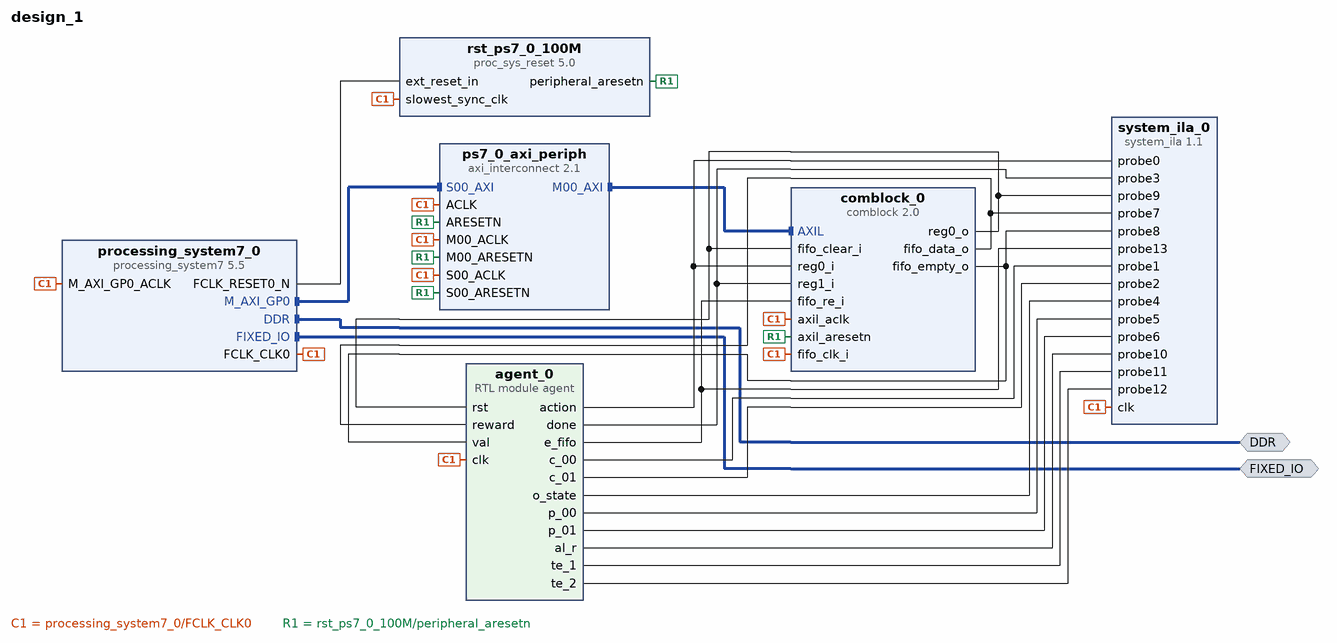
[diagram p0: block diagram of the top level]
# Vivado block design design_1, xc7z020clg484-1, Vivado 2022.1
create_bd_design design_1

create_bd_intf_port -mode Master -vlnv xilinx.com:interface:ddrx_rtl:1.0 DDR
create_bd_intf_port -mode Master -vlnv xilinx.com:display_processing_system7:fixedio_rtl:1.0 FIXED_IO

create_bd_cell -type ip -vlnv xilinx.com:ip:processing_system7:5.5 processing_system7_0
set_property -dict [list \
  CONFIG.PCW_APU_PERIPHERAL_FREQMHZ 666.666667 \
  CONFIG.PCW_ENET0_ENET0_IO {MIO 16 .. 27} \
  CONFIG.PCW_ENET0_GRP_MDIO_ENABLE 1 \
  CONFIG.PCW_ENET0_GRP_MDIO_IO {MIO 52 .. 53} \
  CONFIG.PCW_ENET0_PERIPHERAL_ENABLE 1 \
  CONFIG.PCW_ENET0_RESET_ENABLE 0 \
  CONFIG.PCW_ENET_RESET_ENABLE 1 \
  CONFIG.PCW_ENET_RESET_SELECT {Share reset pin} \
  CONFIG.PCW_FPGA0_PERIPHERAL_FREQMHZ 100 \
  CONFIG.PCW_FPGA1_PERIPHERAL_FREQMHZ 100 \
  CONFIG.PCW_GPIO_MIO_GPIO_ENABLE 1 \
  CONFIG.PCW_GPIO_MIO_GPIO_IO MIO \
  CONFIG.PCW_I2C_RESET_ENABLE 1 \
  CONFIG.PCW_PRESET_BANK1_VOLTAGE {LVCMOS 1.8V} \
  CONFIG.PCW_QSPI_GRP_SINGLE_SS_ENABLE 1 \
  CONFIG.PCW_QSPI_GRP_SINGLE_SS_IO {MIO 1 .. 6} \
  CONFIG.PCW_QSPI_PERIPHERAL_ENABLE 1 \
  CONFIG.PCW_QSPI_QSPI_IO {MIO 1 .. 6} \
  CONFIG.PCW_SD0_GRP_CD_ENABLE 1 \
  CONFIG.PCW_SD0_GRP_CD_IO {MIO 47} \
  CONFIG.PCW_SD0_GRP_WP_ENABLE 1 \
  CONFIG.PCW_SD0_GRP_WP_IO {MIO 46} \
  CONFIG.PCW_SD0_PERIPHERAL_ENABLE 1 \
  CONFIG.PCW_SD0_SD0_IO {MIO 40 .. 45} \
  CONFIG.PCW_SDIO_PERIPHERAL_FREQMHZ 50 \
  CONFIG.PCW_SINGLE_QSPI_DATA_MODE x4 \
  CONFIG.PCW_TTC0_PERIPHERAL_ENABLE 1 \
  CONFIG.PCW_TTC0_TTC0_IO EMIO \
  CONFIG.PCW_UART1_PERIPHERAL_ENABLE 1 \
  CONFIG.PCW_UART1_UART1_IO {MIO 48 .. 49} \
  CONFIG.PCW_UART_PERIPHERAL_FREQMHZ 50 \
  CONFIG.PCW_UIPARAM_DDR_FREQ_MHZ 533.333313 \
  CONFIG.PCW_UIPARAM_DDR_PARTNO {MT41J128M16 HA-15E} \
  CONFIG.PCW_USB0_PERIPHERAL_ENABLE 1 \
  CONFIG.PCW_USB0_RESET_ENABLE 0 \
  CONFIG.PCW_USB0_USB0_IO {MIO 28 .. 39} \
  CONFIG.PCW_USB_RESET_ENABLE 1 \
  CONFIG.PCW_USB_RESET_SELECT {Share reset pin} \
  CONFIG.preset ZedBoard \
] [get_bd_cells processing_system7_0]
# 224 more settings of processing_system7_0 are not shown: defaults, MIO pin electricals, DDR timing, and values the tool derives
create_bd_cell -type ip -vlnv www.ictp.it:user:comblock:2.0 comblock_0
set_property -dict [list \
  CONFIG.DRAM_IO_ENA false \
  CONFIG.FIFO_IN_ENA false \
  CONFIG.FIFO_OUT_DEPTH 1 \
  CONFIG.FIFO_OUT_ENA true \
  CONFIG.REGS_IN_DEPTH 2 \
  CONFIG.REGS_IN_DWIDTH 16 \
  CONFIG.REGS_OUT_DEPTH 1 \
  CONFIG.REGS_OUT_DWIDTH 1 \
] [get_bd_cells comblock_0]
create_bd_cell -type ip -vlnv xilinx.com:ip:axi_interconnect:2.1 ps7_0_axi_periph
set_property -dict {CONFIG.NUM_MI 1} [get_bd_cells ps7_0_axi_periph]
create_bd_cell -type ip -vlnv xilinx.com:ip:proc_sys_reset:5.0 rst_ps7_0_100M
create_bd_cell -type ip -vlnv xilinx.com:ip:system_ila:1.1 system_ila_0
set_property -dict [list \
  CONFIG.C_MON_TYPE NATIVE \
  CONFIG.C_NUM_OF_PROBES 14 \
  CONFIG.C_PROBE0_TYPE 0 \
  CONFIG.C_PROBE10_TYPE 0 \
  CONFIG.C_PROBE11_TYPE 0 \
  CONFIG.C_PROBE12_TYPE 0 \
  CONFIG.C_PROBE13_TYPE 0 \
  CONFIG.C_PROBE1_TYPE 0 \
  CONFIG.C_PROBE2_TYPE 0 \
  CONFIG.C_PROBE3_TYPE 0 \
  CONFIG.C_PROBE4_TYPE 0 \
  CONFIG.C_PROBE5_TYPE 0 \
  CONFIG.C_PROBE6_TYPE 0 \
  CONFIG.C_PROBE7_TYPE 0 \
  CONFIG.C_PROBE8_TYPE 0 \
  CONFIG.C_PROBE9_TYPE 0 \
] [get_bd_cells system_ila_0]
create_bd_cell -type module -reference agent agent_0
set_property -dict {CONFIG.alf 1 CONFIG.bin 64 CONFIG.div 8 CONFIG.res 24} [get_bd_cells agent_0]

# ---- connections ----

connect_bd_intf_net [get_bd_intf_ports DDR] [get_bd_intf_pins processing_system7_0/DDR]
connect_bd_intf_net [get_bd_intf_ports FIXED_IO] [get_bd_intf_pins processing_system7_0/FIXED_IO]
connect_bd_intf_net [get_bd_intf_pins processing_system7_0/M_AXI_GP0] [get_bd_intf_pins ps7_0_axi_periph/S00_AXI]
connect_bd_intf_net [get_bd_intf_pins ps7_0_axi_periph/M00_AXI] [get_bd_intf_pins comblock_0/AXIL]
connect_bd_net -net agent_0_action [get_bd_pins agent_0/action] [get_bd_pins comblock_0/reg0_i] [get_bd_pins system_ila_0/probe0]
connect_bd_net -net agent_0_c_00 [get_bd_pins agent_0/c_00] [get_bd_pins system_ila_0/probe1]
connect_bd_net -net agent_0_c_01 [get_bd_pins agent_0/c_01] [get_bd_pins system_ila_0/probe2]
connect_bd_net -net agent_0_done [get_bd_pins agent_0/done] [get_bd_pins comblock_0/reg1_i] [get_bd_pins system_ila_0/probe3]
connect_bd_net -net agent_0_e_fifo [get_bd_pins agent_0/e_fifo] [get_bd_pins comblock_0/fifo_re_i] [get_bd_pins system_ila_0/probe13]
connect_bd_net -net agent_0_o_state [get_bd_pins agent_0/o_state] [get_bd_pins system_ila_0/probe4]
connect_bd_net -net agent_0_p_00 [get_bd_pins agent_0/p_00] [get_bd_pins system_ila_0/probe5]
connect_bd_net -net agent_0_p_01 [get_bd_pins agent_0/p_01] [get_bd_pins system_ila_0/probe6]
connect_bd_net -net al_r [get_bd_pins agent_0/al_r] [get_bd_pins system_ila_0/probe10]
connect_bd_net -net comblock_0_fifo_data_o [get_bd_pins comblock_0/fifo_data_o] [get_bd_pins system_ila_0/probe7] [get_bd_pins agent_0/reward]
connect_bd_net -net comblock_0_fifo_valid_o [get_bd_pins comblock_0/fifo_empty_o] [get_bd_pins system_ila_0/probe8] [get_bd_pins agent_0/val]
connect_bd_net -net comblock_0_reg0_o [get_bd_pins comblock_0/reg0_o] \
  [get_bd_pins comblock_0/fifo_clear_i] [get_bd_pins system_ila_0/probe9] [get_bd_pins agent_0/rst]
connect_bd_net [get_bd_pins processing_system7_0/FCLK_CLK0] \
  [get_bd_pins processing_system7_0/M_AXI_GP0_ACLK] [get_bd_pins ps7_0_axi_periph/S00_ACLK] \
  [get_bd_pins rst_ps7_0_100M/slowest_sync_clk] [get_bd_pins comblock_0/axil_aclk] [get_bd_pins ps7_0_axi_periph/M00_ACLK] \
  [get_bd_pins ps7_0_axi_periph/ACLK] [get_bd_pins comblock_0/fifo_clk_i] [get_bd_pins system_ila_0/clk] \
  [get_bd_pins agent_0/clk]
connect_bd_net [get_bd_pins processing_system7_0/FCLK_RESET0_N] [get_bd_pins rst_ps7_0_100M/ext_reset_in]
connect_bd_net [get_bd_pins rst_ps7_0_100M/peripheral_aresetn] \
  [get_bd_pins ps7_0_axi_periph/S00_ARESETN] [get_bd_pins comblock_0/axil_aresetn] [get_bd_pins ps7_0_axi_periph/M00_ARESETN] \
  [get_bd_pins ps7_0_axi_periph/ARESETN]
connect_bd_net -net te_1 [get_bd_pins agent_0/te_1] [get_bd_pins system_ila_0/probe11]
connect_bd_net -net te_2 [get_bd_pins agent_0/te_2] [get_bd_pins system_ila_0/probe12]
set_property HDL_ATTRIBUTE.DEBUG true [get_bd_nets agent_0_action]
set_property HDL_ATTRIBUTE.MARK_DEBUG true [get_bd_nets agent_0_action]
set_property HDL_ATTRIBUTE.DEBUG true [get_bd_nets agent_0_c_00]
set_property HDL_ATTRIBUTE.MARK_DEBUG true [get_bd_nets agent_0_c_00]
set_property HDL_ATTRIBUTE.DEBUG true [get_bd_nets agent_0_c_01]
set_property HDL_ATTRIBUTE.MARK_DEBUG true [get_bd_nets agent_0_c_01]
set_property HDL_ATTRIBUTE.DEBUG true [get_bd_nets agent_0_done]
set_property HDL_ATTRIBUTE.MARK_DEBUG true [get_bd_nets agent_0_done]
set_property HDL_ATTRIBUTE.DEBUG true [get_bd_nets agent_0_e_fifo]
set_property HDL_ATTRIBUTE.MARK_DEBUG true [get_bd_nets agent_0_e_fifo]
set_property HDL_ATTRIBUTE.DEBUG true [get_bd_nets agent_0_o_state]
set_property HDL_ATTRIBUTE.MARK_DEBUG true [get_bd_nets agent_0_o_state]
set_property HDL_ATTRIBUTE.DEBUG true [get_bd_nets agent_0_p_00]
set_property HDL_ATTRIBUTE.MARK_DEBUG true [get_bd_nets agent_0_p_00]
set_property HDL_ATTRIBUTE.DEBUG true [get_bd_nets agent_0_p_01]
set_property HDL_ATTRIBUTE.MARK_DEBUG true [get_bd_nets agent_0_p_01]
set_property HDL_ATTRIBUTE.DEBUG true [get_bd_nets al_r]
set_property HDL_ATTRIBUTE.MARK_DEBUG true [get_bd_nets al_r]
set_property HDL_ATTRIBUTE.DEBUG true [get_bd_nets comblock_0_fifo_data_o]
set_property HDL_ATTRIBUTE.MARK_DEBUG true [get_bd_nets comblock_0_fifo_data_o]
set_property HDL_ATTRIBUTE.DEBUG true [get_bd_nets comblock_0_fifo_valid_o]
set_property HDL_ATTRIBUTE.MARK_DEBUG true [get_bd_nets comblock_0_fifo_valid_o]
set_property HDL_ATTRIBUTE.DEBUG true [get_bd_nets comblock_0_reg0_o]
set_property HDL_ATTRIBUTE.MARK_DEBUG true [get_bd_nets comblock_0_reg0_o]
set_property HDL_ATTRIBUTE.DEBUG true [get_bd_nets te_1]
set_property HDL_ATTRIBUTE.MARK_DEBUG true [get_bd_nets te_1]
set_property HDL_ATTRIBUTE.DEBUG true [get_bd_nets te_2]
set_property HDL_ATTRIBUTE.MARK_DEBUG true [get_bd_nets te_2]

# ---- address map ----
assign_bd_address -offset 0x43C00000 -range 64K -target_address_space [get_bd_addr_spaces processing_system7_0/Data] [get_bd_addr_segs comblock_0/AXIL/AXIL]

validate_bd_design
save_bd_design
